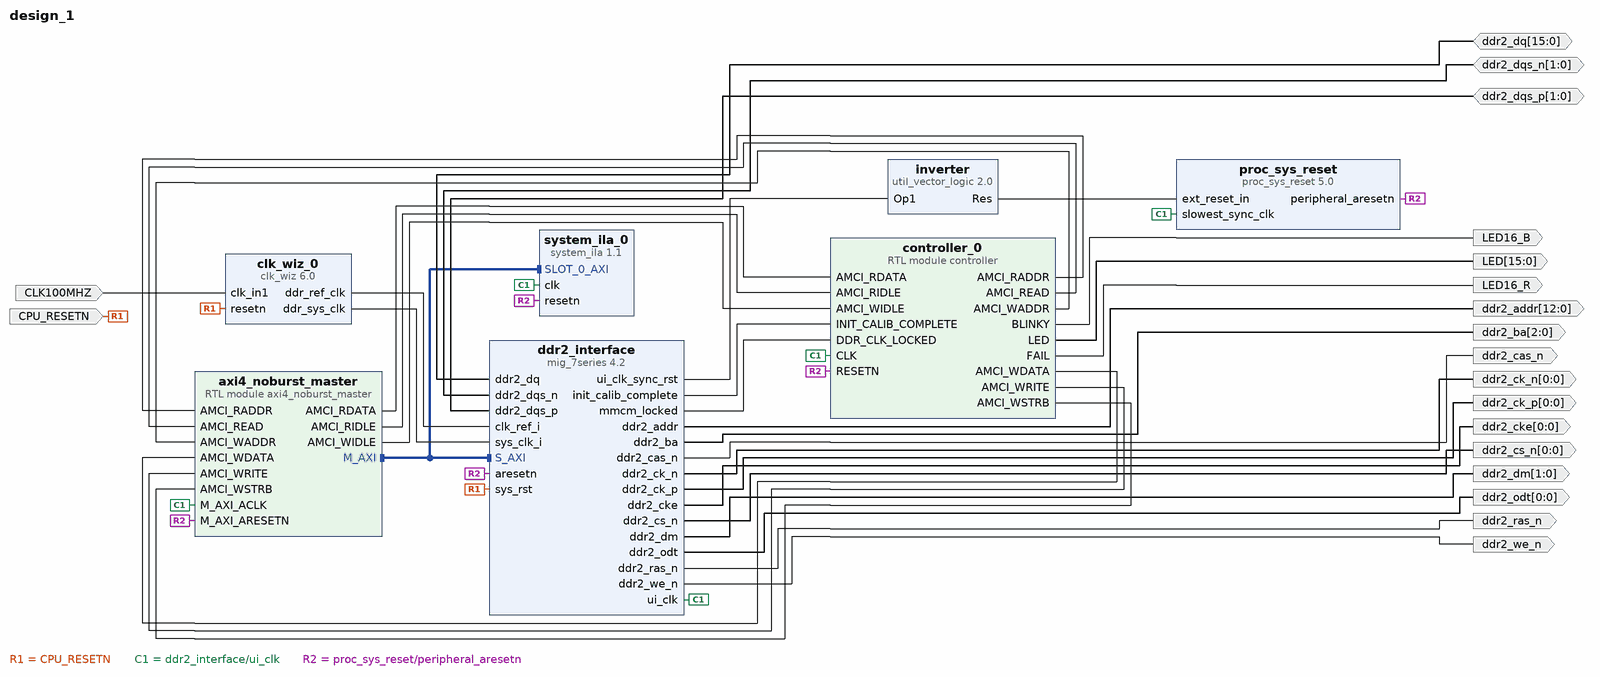
[diagram p0: block diagram of the top level]
# Vivado block design design_1, xc7a100tcsg324-1, Vivado 2021.2
create_bd_design design_1

create_bd_port -dir O ddr2_cas_n
create_bd_port -dir O ddr2_ras_n
create_bd_port -dir IO -from 15 -to 0 ddr2_dq
create_bd_port -dir O -from 1 -to 0 ddr2_dm
create_bd_port -dir IO -from 1 -to 0 ddr2_dqs_n
create_bd_port -dir O -from 0 -to 0 ddr2_cs_n
create_bd_port -dir IO -from 1 -to 0 ddr2_dqs_p
create_bd_port -dir O -from 0 -to 0 -type clk ddr2_ck_p
create_bd_port -dir O ddr2_we_n
create_bd_port -dir O -from 0 -to 0 ddr2_cke
create_bd_port -dir O -from 0 -to 0 -type clk ddr2_ck_n
create_bd_port -dir O -from 2 -to 0 ddr2_ba
create_bd_port -dir O -from 12 -to 0 ddr2_addr
create_bd_port -dir O -from 0 -to 0 ddr2_odt
create_bd_port -dir I -type clk CLK100MHZ
create_bd_port -dir I -type rst CPU_RESETN
create_bd_port -dir O LED16_B
create_bd_port -dir O -from 15 -to 0 LED
create_bd_port -dir O LED16_R

create_bd_cell -type ip -vlnv xilinx.com:ip:mig_7series:4.2 ddr2_interface
set_property -dict [list \
  CONFIG.BOARD_MIG_PARAM Custom \
  CONFIG.MIG_DONT_TOUCH_PARAM Custom \
  CONFIG.RESET_BOARD_INTERFACE Custom \
  CONFIG.XML_INPUT_FILE mig_a.prj \
] [get_bd_cells ddr2_interface]
create_bd_cell -type ip -vlnv xilinx.com:ip:clk_wiz:6.0 clk_wiz_0
set_property -dict [list \
  CONFIG.CLKOUT1_DRIVES BUFGCE \
  CONFIG.CLKOUT1_JITTER 114.140 \
  CONFIG.CLKOUT1_PHASE_ERROR 99.281 \
  CONFIG.CLKOUT1_REQUESTED_OUT_FREQ 200.00 \
  CONFIG.CLKOUT2_DRIVES BUFGCE \
  CONFIG.CLKOUT2_JITTER 104.357 \
  CONFIG.CLKOUT2_PHASE_ERROR 99.281 \
  CONFIG.CLKOUT2_REQUESTED_OUT_FREQ 325.00 \
  CONFIG.CLKOUT2_USED true \
  CONFIG.CLKOUT3_DRIVES BUFGCE \
  CONFIG.CLKOUT4_DRIVES BUFGCE \
  CONFIG.CLKOUT5_DRIVES BUFGCE \
  CONFIG.CLKOUT6_DRIVES BUFGCE \
  CONFIG.CLKOUT7_DRIVES BUFGCE \
  CONFIG.CLK_OUT1_PORT ddr_ref_clk \
  CONFIG.CLK_OUT2_PORT ddr_sys_clk \
  CONFIG.FEEDBACK_SOURCE FDBK_AUTO \
  CONFIG.MMCM_BANDWIDTH OPTIMIZED \
  CONFIG.MMCM_CLKFBOUT_MULT_F 9.750 \
  CONFIG.MMCM_CLKOUT0_DIVIDE_F 4.875 \
  CONFIG.MMCM_CLKOUT1_DIVIDE 3 \
  CONFIG.MMCM_COMPENSATION ZHOLD \
  CONFIG.NUM_OUT_CLKS 2 \
  CONFIG.PRIMITIVE MMCM \
  CONFIG.RESET_PORT resetn \
  CONFIG.RESET_TYPE ACTIVE_LOW \
  CONFIG.USE_LOCKED false \
  CONFIG.USE_SAFE_CLOCK_STARTUP true \
] [get_bd_cells clk_wiz_0]
create_bd_cell -type ip -vlnv xilinx.com:ip:proc_sys_reset:5.0 proc_sys_reset
create_bd_cell -type ip -vlnv xilinx.com:ip:util_vector_logic:2.0 inverter
set_property -dict {CONFIG.C_OPERATION not CONFIG.C_SIZE 1} [get_bd_cells inverter]
create_bd_cell -type ip -vlnv xilinx.com:ip:system_ila:1.1 system_ila_0
set_property -dict [list \
  CONFIG.C_MON_TYPE INTERFACE \
  CONFIG.C_NUM_MONITOR_SLOTS 1 \
  CONFIG.C_SLOT_0_APC_EN 0 \
  CONFIG.C_SLOT_0_AXI_AR_SEL_DATA 1 \
  CONFIG.C_SLOT_0_AXI_AR_SEL_TRIG 1 \
  CONFIG.C_SLOT_0_AXI_AW_SEL_DATA 1 \
  CONFIG.C_SLOT_0_AXI_AW_SEL_TRIG 1 \
  CONFIG.C_SLOT_0_AXI_B_SEL_DATA 1 \
  CONFIG.C_SLOT_0_AXI_B_SEL_TRIG 1 \
  CONFIG.C_SLOT_0_AXI_R_SEL_DATA 1 \
  CONFIG.C_SLOT_0_AXI_R_SEL_TRIG 1 \
  CONFIG.C_SLOT_0_AXI_W_SEL_DATA 1 \
  CONFIG.C_SLOT_0_AXI_W_SEL_TRIG 1 \
  CONFIG.C_SLOT_0_INTF_TYPE xilinx.com:interface:aximm_rtl:1.0 \
] [get_bd_cells system_ila_0]
create_bd_cell -type module -reference axi4_noburst_master axi4_noburst_master
create_bd_cell -type module -reference controller controller_0

# ---- connections ----

connect_bd_intf_net -intf_net axi4_noburst_master_M_AXI [get_bd_intf_pins axi4_noburst_master/M_AXI] [get_bd_intf_pins ddr2_interface/S_AXI]
connect_bd_intf_net [get_bd_intf_pins axi4_noburst_master/M_AXI] [get_bd_intf_pins system_ila_0/SLOT_0_AXI]
connect_bd_net [get_bd_ports CPU_RESETN] [get_bd_pins ddr2_interface/sys_rst] [get_bd_pins clk_wiz_0/resetn]
connect_bd_net [get_bd_ports ddr2_dq] [get_bd_pins ddr2_interface/ddr2_dq]
connect_bd_net [get_bd_ports ddr2_dqs_n] [get_bd_pins ddr2_interface/ddr2_dqs_n]
connect_bd_net [get_bd_ports ddr2_dqs_p] [get_bd_pins ddr2_interface/ddr2_dqs_p]
connect_bd_net [get_bd_pins axi4_noburst_master/AMCI_RDATA] [get_bd_pins controller_0/AMCI_RDATA]
connect_bd_net [get_bd_pins axi4_noburst_master/AMCI_RIDLE] [get_bd_pins controller_0/AMCI_RIDLE]
connect_bd_net [get_bd_pins axi4_noburst_master/AMCI_WIDLE] [get_bd_pins controller_0/AMCI_WIDLE]
connect_bd_net -net clk_in1_0_1 [get_bd_ports CLK100MHZ] [get_bd_pins clk_wiz_0/clk_in1]
connect_bd_net [get_bd_pins clk_wiz_0/ddr_ref_clk] [get_bd_pins ddr2_interface/clk_ref_i]
connect_bd_net [get_bd_pins clk_wiz_0/ddr_sys_clk] [get_bd_pins ddr2_interface/sys_clk_i]
connect_bd_net [get_bd_pins controller_0/AMCI_RADDR] [get_bd_pins axi4_noburst_master/AMCI_RADDR]
connect_bd_net [get_bd_pins controller_0/AMCI_READ] [get_bd_pins axi4_noburst_master/AMCI_READ]
connect_bd_net [get_bd_pins controller_0/AMCI_WADDR] [get_bd_pins axi4_noburst_master/AMCI_WADDR]
connect_bd_net [get_bd_pins controller_0/AMCI_WDATA] [get_bd_pins axi4_noburst_master/AMCI_WDATA]
connect_bd_net [get_bd_pins controller_0/AMCI_WRITE] [get_bd_pins axi4_noburst_master/AMCI_WRITE]
connect_bd_net [get_bd_pins controller_0/AMCI_WSTRB] [get_bd_pins axi4_noburst_master/AMCI_WSTRB]
connect_bd_net [get_bd_pins controller_0/BLINKY] [get_bd_ports LED16_B]
connect_bd_net [get_bd_pins controller_0/FAIL] [get_bd_ports LED16_R]
connect_bd_net [get_bd_pins controller_0/LED] [get_bd_ports LED]
connect_bd_net [get_bd_pins ddr2_interface/init_calib_complete] [get_bd_pins controller_0/INIT_CALIB_COMPLETE]
connect_bd_net [get_bd_pins ddr2_interface/mmcm_locked] [get_bd_pins controller_0/DDR_CLK_LOCKED]
connect_bd_net [get_bd_pins ddr2_interface/ui_clk] \
  [get_bd_pins proc_sys_reset/slowest_sync_clk] [get_bd_pins system_ila_0/clk] [get_bd_pins axi4_noburst_master/M_AXI_ACLK] \
  [get_bd_pins controller_0/CLK]
connect_bd_net [get_bd_pins ddr2_interface/ui_clk_sync_rst] [get_bd_pins inverter/Op1]
connect_bd_net [get_bd_pins inverter/Res] [get_bd_pins proc_sys_reset/ext_reset_in]
connect_bd_net -net mig_7series_0_ddr2_addr [get_bd_pins ddr2_interface/ddr2_addr] [get_bd_ports ddr2_addr]
connect_bd_net -net mig_7series_0_ddr2_ba [get_bd_pins ddr2_interface/ddr2_ba] [get_bd_ports ddr2_ba]
connect_bd_net -net mig_7series_0_ddr2_cas_n [get_bd_pins ddr2_interface/ddr2_cas_n] [get_bd_ports ddr2_cas_n]
connect_bd_net -net mig_7series_0_ddr2_ck_n [get_bd_pins ddr2_interface/ddr2_ck_n] [get_bd_ports ddr2_ck_n]
connect_bd_net -net mig_7series_0_ddr2_ck_p [get_bd_pins ddr2_interface/ddr2_ck_p] [get_bd_ports ddr2_ck_p]
connect_bd_net -net mig_7series_0_ddr2_cke [get_bd_pins ddr2_interface/ddr2_cke] [get_bd_ports ddr2_cke]
connect_bd_net -net mig_7series_0_ddr2_cs_n [get_bd_pins ddr2_interface/ddr2_cs_n] [get_bd_ports ddr2_cs_n]
connect_bd_net -net mig_7series_0_ddr2_dm [get_bd_pins ddr2_interface/ddr2_dm] [get_bd_ports ddr2_dm]
connect_bd_net -net mig_7series_0_ddr2_odt [get_bd_pins ddr2_interface/ddr2_odt] [get_bd_ports ddr2_odt]
connect_bd_net -net mig_7series_0_ddr2_ras_n [get_bd_pins ddr2_interface/ddr2_ras_n] [get_bd_ports ddr2_ras_n]
connect_bd_net -net mig_7series_0_ddr2_we_n [get_bd_pins ddr2_interface/ddr2_we_n] [get_bd_ports ddr2_we_n]
connect_bd_net [get_bd_pins proc_sys_reset/peripheral_aresetn] \
  [get_bd_pins ddr2_interface/aresetn] [get_bd_pins system_ila_0/resetn] [get_bd_pins axi4_noburst_master/M_AXI_ARESETN] \
  [get_bd_pins controller_0/RESETN]
set_property HDL_ATTRIBUTE.DEBUG true [get_bd_intf_nets axi4_noburst_master_M_AXI]
set_property HDL_ATTRIBUTE.MARK_DEBUG true [get_bd_intf_nets axi4_noburst_master_M_AXI]

# ---- address map ----
assign_bd_address -offset 0x80000000 -range 128M -target_address_space [get_bd_addr_spaces axi4_noburst_master/M_AXI] [get_bd_addr_segs ddr2_interface/memmap/memaddr]

validate_bd_design
save_bd_design
